# Altium project VHF_AMP.PrjPcb (part 5 of 5)

## Sheet VHFA_PWR_Supply.SchDoc: =MainTitle
size 420 x 297 mm; EDA_Number: ARTIQ; Projet: ARTIQ/SINARA; Author: G.Kasprowicz; CompanyName: WUT ISE; DrawnBy: G.Kasprowicz; Organization: WUT ISE; Address1: PW ISE; Address2: Nowowiejska 15/19 00-665 Warsaw; Address3: gkasprow@gmail.com; DocumentNumber: 5; Revision: 2; SheetNumber: 9; SheetTotal: 9; ModifiedBy: -; CheckedDate: -; Title2: Power supply & fan; DivGrp: WUT ISE; Designer: G.Kasprowicz; ModifiedDate: -; ProjectName: Sensor Box
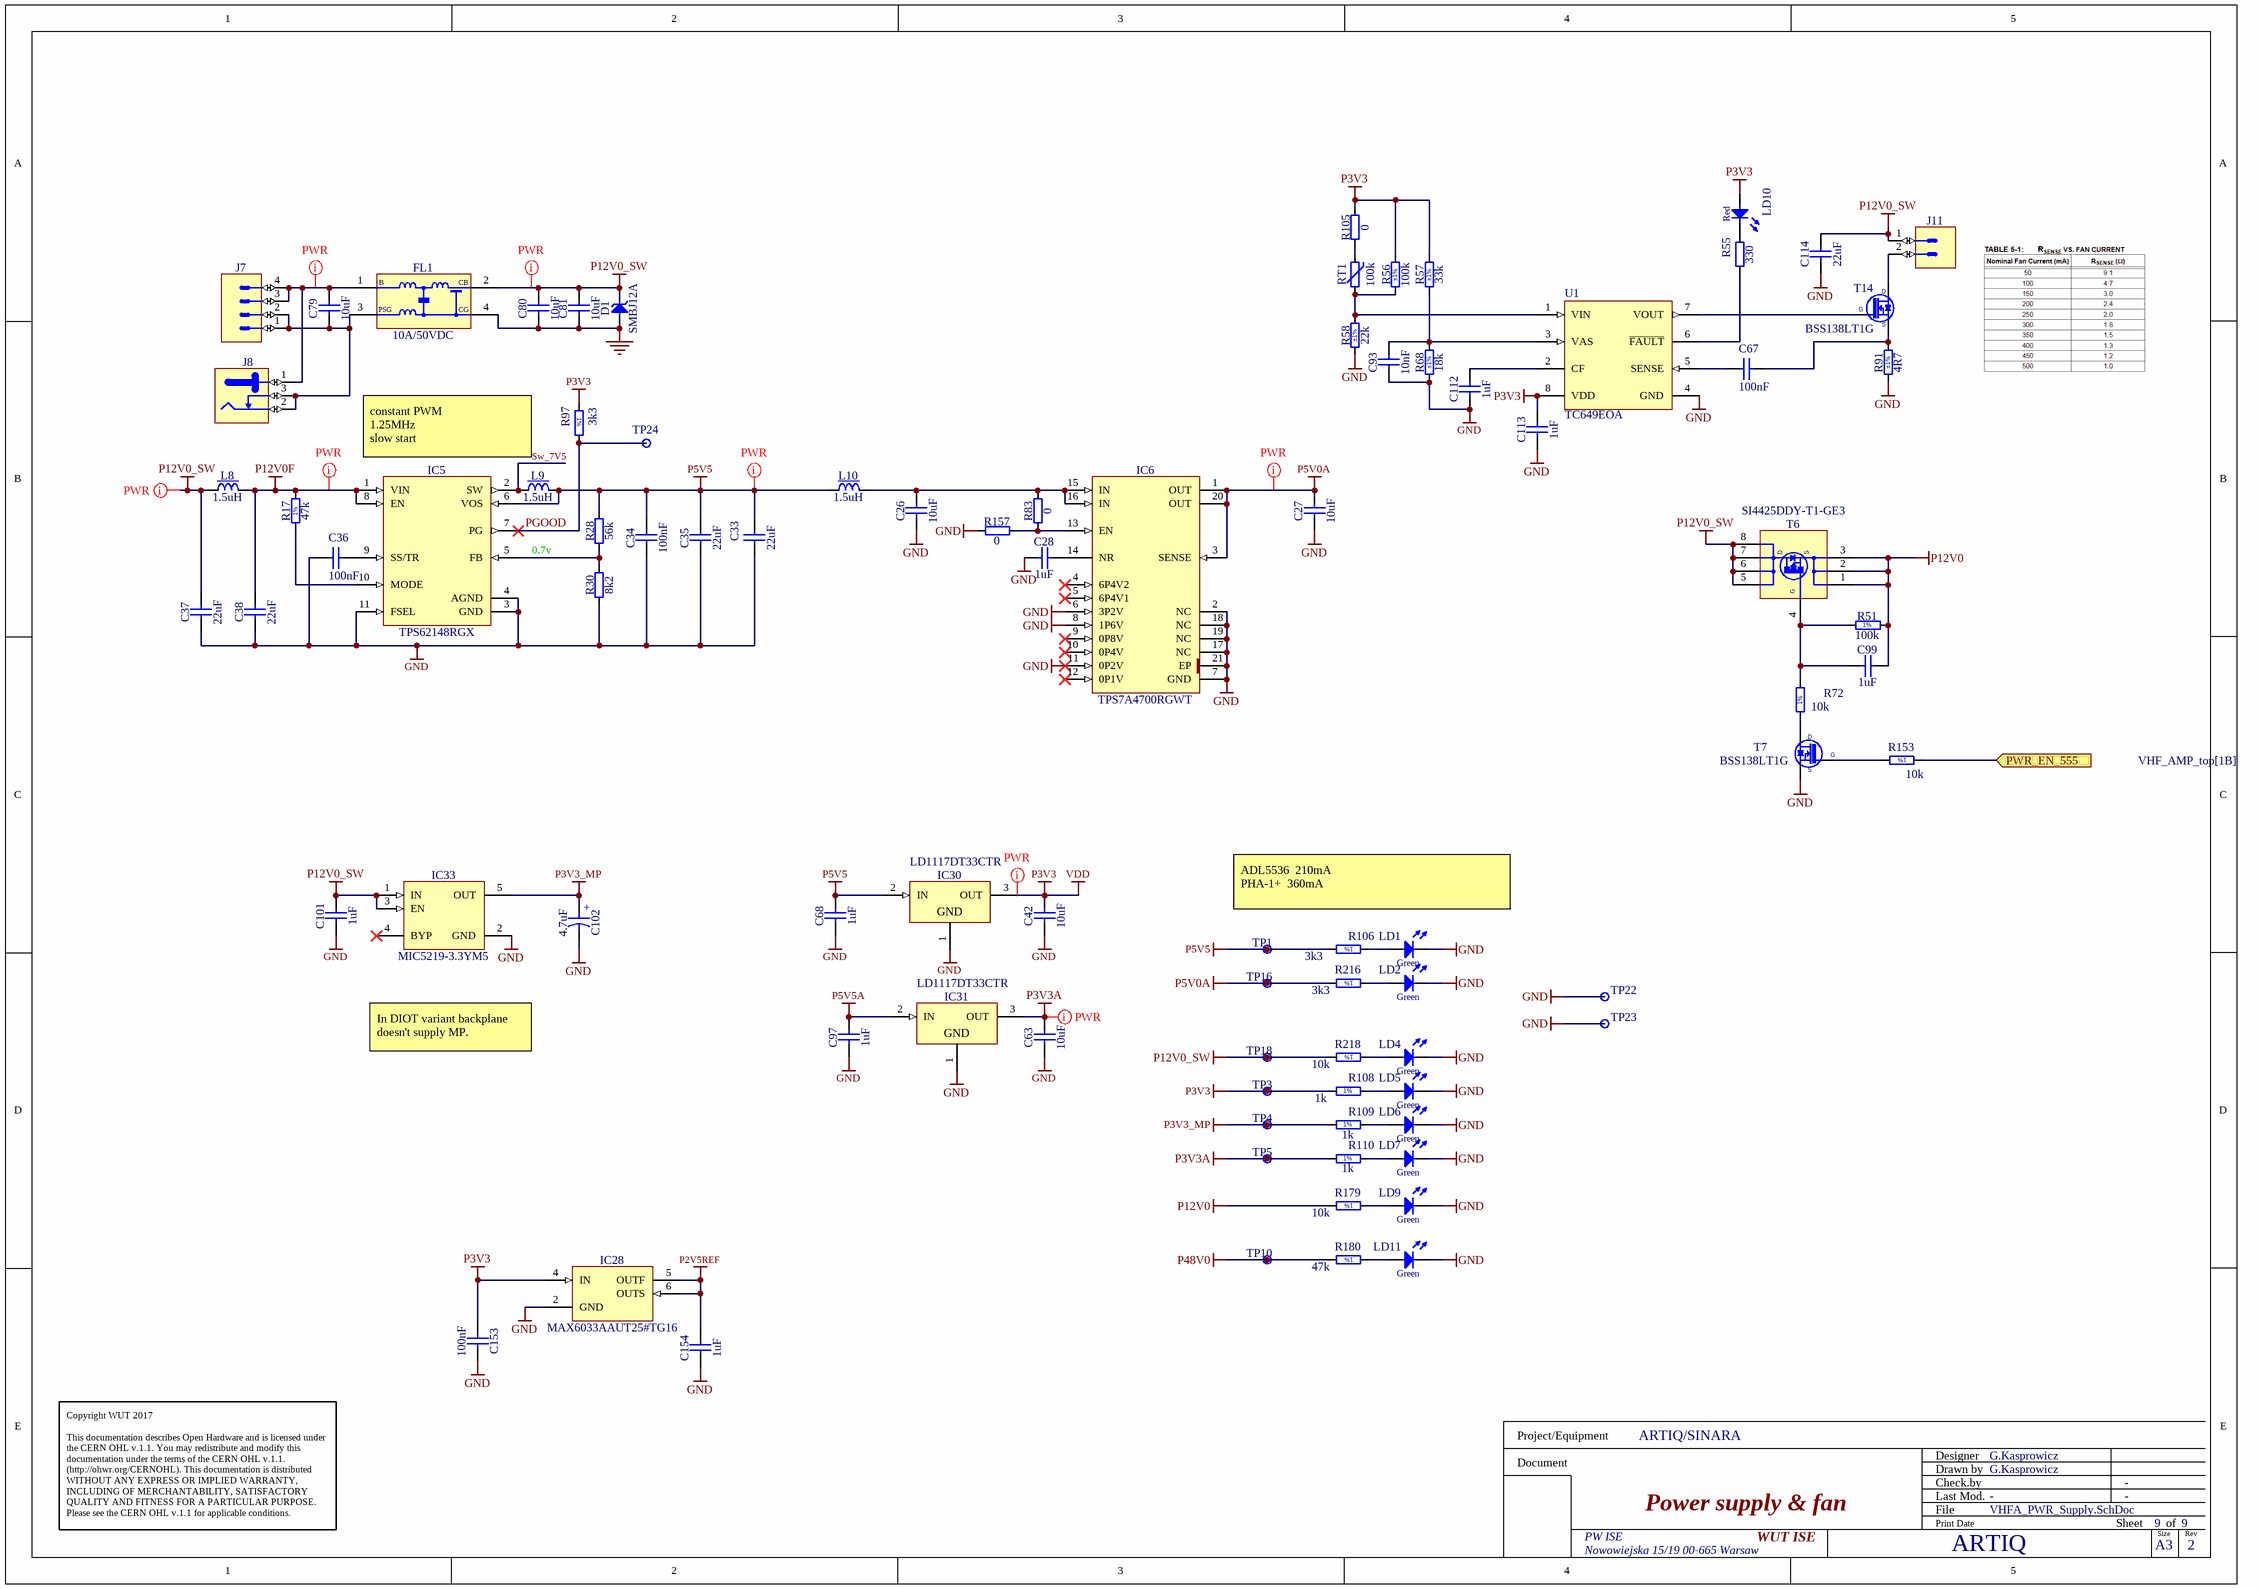
[diagram p8: VHFA_PWR_Supply.SchDoc]

### Parts
C26  10uF  [CAPC3216X140N]
C27  10uF  [CAPC3216X140N]
C28  1uF  [CAPC1608X87N]
C33  22uF  [CAPC3216X180N]
C34  100nF  [CAPC1005X55N]
C35  22uF  [CAPC3216X180N]
C36  100nF  [CAPC1005X55N]
C37  22uF  [CAPC3216X180N]
C38  22uF  [CAPC3216X180N]
C42  10uF  [CAPC3216X140N]
C63  10uF  [CAPC3216X140N]
C67  100nF  [CAPC1005X55N]
C68  1uF  [CAPC1608X87N]
C79  10uF  [CAPC2012X95N]
C80  10uF  [CAPC2012X95N]
C81  10uF  [CAPC2012X95N]
C93  10nF  [CAPC1608X87N]
C97  1uF  [CAPC1608X87N]
C99  1uF  [CAPC1005X55N]
C101  1uF  [CAPC1608X87N]
C102  4.7uF  [CAPMP3216X180N]
C112  1uF  [CAPC1608X87N]
C113  1uF  [CAPC1608X87N]
C114  22uF  [CAPC3216X180N]
C153  100nF  [CAPC1005X55N]
C154  1uF  [CAPC2012X110N]
D1  SMBJ12A  [DIOM5336X265N]
FL1  10A/50VDC  [FIL_MURATA_BNX02]
IC5  TPS62148RGX  [TEXAS_RGX0011A]
IC6  TPS7A4700RGWT  [QFN65P500X500X100-21N-S325]
IC28  MAX6033AAUT25#TG16  [SOT95P280X145-6N]
IC30  LD1117DT33CTR  [TO228P972X240-3N-R540X510]
IC31  LD1117DT33CTR  [TO228P972X240-3N-R540X510]
IC33  MIC5219-3.3YM5  [SOT95P280X145-5N]
J7  Mini-Fit Jr.™  [MOLEX_39-30-0040]  (value not drawn)
J8  Jack  [SWITCHCRAFT_712RA]  (value not drawn)
J11  KK®  [MOLEX_22-04-1021]  (value not drawn)
L8  1.5uH  [IND_TDK_SPM6530]
L9  1.5uH  [IND_TDK_SPM6530]
L10  1.5uH  [IND_TDK_SPM6530]
LD1  Green  [LED_KINGBRIGHT_KPH-1608CGCK]
LD2  Green  [LED_KINGBRIGHT_KPH-1608CGCK]
LD4  Green  [LED_KINGBRIGHT_KPH-1608CGCK]
LD5  Green  [LED_KINGBRIGHT_KPH-1608CGCK]
LD6  Green  [LED_KINGBRIGHT_KPH-1608CGCK]
LD7  Green  [LED_KINGBRIGHT_KPH-1608CGCK]
LD9  Green  [LED_KINGBRIGHT_KPH-1608CGCK]
LD10  Red  [LED_AVAGO_HSMC-C120]
LD11  Green  [LED_KINGBRIGHT_KPH-1608CGCK]
R17  47k  [RESC1608X55N]
R28  56k  [RESC1608X55N]
R30  8k2  [RESC1608X55N]
R51  100k  [RESC1608X55N]
R55  330  [RESC1005X40N]
R56  100k  Tolerance: ±1%  [RESC1005X40N]
R57  33k  Tolerance: ±1%  [RESC1005X40N]
R58  22k  Tolerance: ±1%  [RESC1005X40N]
R68  18k  Tolerance: ±1%  [RESC1005X40N]
R72  10k  [RESC1005X40N]
R83  0  [RESC1608X55N]
R91  4R7  Tolerance: ±1%  [RESC2012X60N]
R97  3k3  [RESC1608X55N]
R105  0  [RESC1005X40N]
R106  3k3  [RESC1608X55N]
R108  1k  [RESC1608X55N]
R109  1k  [RESC1608X55N]
R110  1k  [RESC1608X55N]
R153  10k  [RESC1005X40N]
R157  0  [RESC1608X55N]
R179  10k  [RESC1005X40N]
R180  47k  [RESC1005X40N]
R216  3k3  [RESC1608X55N]
R218  10k  [RESC1005X40N]
RT1  100k  [THERMC1608X95N]
T6  SI4425DDY-T1-GE3  [SOIC127P600X175-8N]
T7  BSS138LT1G  [SOT95P240X110-3N]
T14  BSS138LT1G  [SOT95P240X110-3N]
TP1  Test Point  [TPS127]  (value not drawn)
TP3  Test Point  [TPS127]  (value not drawn)
TP4  Test Point  [TPS127]  (value not drawn)
TP5  Test Point  [TPS127]  (value not drawn)
TP10  Test Point  [TPS127]  (value not drawn)
TP16  Test Point  [TPS127]  (value not drawn)
TP18  Test Point  [TPS127]  (value not drawn)
TP22  Test Point  [TPS127]  (value not drawn)
TP23  Test Point  [TPS127]  (value not drawn)
TP24  Test Point  [NICOMATIC_C12000B]  (value not drawn)
U1  TC649EOA  [SOIC127P600X175-8N]

### Ports
PWR_EN_555 (in, see VHF_AMP_top[1B])

### Nets
GND: C26.1 C27.1 C28.1 C33.1 C34.1 C35.1 C36.2 C37.1 C38.1 C42.1 C63.1 C68.1 C80.1 C81.1 C93.1 C97.1 C101.1 C102.2 C112.1 C113.1 C114.1 C153.2 C154.1 D1.2(A) FL1.4(CG) IC5.3(GND) IC5.4(AGND) IC5.11(FSEL) IC6.2(NC) IC6.6(3P2V) IC6.7(GND) IC6.8(1P6V) IC6.11(0P2V) IC6.17(NC) IC6.18(NC) IC6.19(NC) IC6.21(EP) IC28.2(GND) IC30.1(GND) IC31.1(GND) IC33.2(GND) LD1.1(C) LD2.1(C) LD4.1(C) LD5.1(C) LD6.1(C) LD7.1(C) LD9.1(C) LD11.1(C) R30.1 R58.1 R68.1 R91.1 R157.1 T7.2(S) TP22.1 TP23.1 U1.4(GND)
P2V5REF: C154.2 IC28.5(OUTF) IC28.6(OUTS)
P3V3: C42.2 C113.2 C153.1 IC28.4(IN) IC30.3(OUT) LD10.2(A) R56.2 R57.2 R97.1 R105.2 R108.1 TP3.1 U1.8(VDD)  [also labelled VDD]
P3V3_MP: C102.1 IC33.5(OUT) R109.1 TP4.1
P3V3A: C63.2 IC31.3(OUT) R110.1 TP5.1
P5V0A: C27.2 IC6.1(OUT) IC6.3(SENSE) IC6.20(OUT) R216.2 TP16.1
P5V5: C33.2 C34.2 C35.2 C68.2 IC5.6(VOS) IC30.2(IN) L9.2 L10.1 R28.2 R106.2 TP1.1
P5V5A: C97.2 IC31.2(IN)
P12V0: C99.2 R51.2 R179.2 T6.1(S) T6.2(S) T6.3(S)
P12V0_SW: C37.2 C80.2 C81.2 C101.2 C114.2 D1.1(C) FL1.2(CB) IC33.1(IN) IC33.3(EN) J11.1 L8.1 R218.2 T6.5(D) T6.6(D) T6.7(D) T6.8(D) TP18.1
P12V0F: C38.2 IC5.1(VIN) IC5.8(EN) L8.2 R17.2
P48V0: R180.2 TP10.1
PGOOD: IC5.7(PG) R97.2 TP24.1
PS_ON_BP: R153.1 ; port PWR_EN_555
Sw_7V5: IC5.2(SW) L9.1
NetC26_2: C26.2 IC6.15(IN) IC6.16(IN) L10.2 R83.2
NetC28_2: C28.2 IC6.14(NR)
NetC36_1: C36.1 IC5.9(SS/TR)
NetC67_1: C67.1 R91.2 T14.2(S)
NetC67_2: C67.2 U1.5(SENSE)
NetC79_1: C79.1 FL1.3(PSG) J7.1 J7.2 J8.2 J8.3
NetC79_2: C79.2 FL1.1(B) J7.3 J7.4 J8.1
NetC93_2: C93.2 R57.1 R68.2 U1.3(VAS)
NetC99_1: C99.1 R51.1 R72.2 T6.4(S)
NetC112_2: C112.2 U1.2(CF)
NetIC5_5: IC5.5(FB) R28.1 R30.2
NetIC5_10: IC5.10(MODE) R17.1
NetIC6_13: IC6.13(EN) R83.1 R157.2
NetJ11_2: J11.2 T14.3(D)
NetLD1_2: LD1.2(A) R106.1
NetLD2_2: LD2.2(A) R216.1
NetLD4_2: LD4.2(A) R218.1
NetLD5_2: LD5.2(A) R108.2
NetLD6_2: LD6.2(A) R109.2
NetLD7_2: LD7.2(A) R110.2
NetLD9_2: LD9.2(A) R179.1
NetLD10_1: LD10.1(C) R55.2
NetLD11_2: LD11.2(A) R180.1
NetR55_1: R55.1 U1.6(~{FAULT})
NetR56_1: R56.1 R58.2 RT1.1 U1.1(VIN)
NetR72_1: R72.1 T7.3(D)
NetR105_1: R105.1 RT1.2
NetR153_2: R153.2 T7.1(G)
NetT14_1: T14.1(G) U1.7(VOUT)

Not connected (* = marked no-connect by the designer): IC6 4(6P4V2)* 5(6P4V1)* 9(0P8V)* 10(0P4V)* 12(0P1V)*; IC33 4(BYP)*

### Layout directives
net class PWR: NetC79_2, P3V3, P3V3A, P5V0A, P5V5, P12V0_SW, P12V0F

### Notes on the sheet
- constant PWM
  1.25MHz
  slow start
- 0.7v
- ADL5536		210mA
  PHA-1+		360mA
- In DIOT variant backplane doesn't supply MP.
- Project/Equipment
- Document
- Designer
- Drawn by
- Check.by
- Copyright WUT 2017
  This documentation describes Open Hardware and is licensed under the CERN OHL v.1.1. You may redistribute and modify this documentation under the terms of the CERN OHL v.1.1. (http://ohwr.org/CERNOHL). This documentation is distributed WITHOUT ANY EXPRESS OR IMPLIED WARRANTY, INCLUDING OF MERCHANTABILITY, SATISFACTORY QUALITY AND FITNESS FOR A PARTICULAR PURPOSE. Please see the CERN OHL v.1.1 for applicable conditions.
- File
- Last Mod.
- Print Date
- Sheet
- Size
- A3
- of
- Rev
- (in symbol CTE3216-18_4.7UF_10V_10%_AVX_TPSA475K010T1400) +
- (in symbol R0402_10K_1%_0.0625W_100PPM) 1%
- (in symbol R0402_47K_1%_0.0625W_100PPM) 1%
- (in symbol R0603_1K_1%_0.1W_100PPM) 1%
- (in symbol R0603_3k3_1%_0.1W_100PPM) 1%
- (in symbol R0603_47K_1%_0.1W_100PPM) 1%
- (in symbol R0603_100K_1%_0.1W_100PPM) 1%
- (in symbol SI4425DDY-T1-GE3) G

### Library data of the parts
C26 C27 C42 C63 = CC1206_10UF_10V_10%_X7R: Non-polarised capacitor; Part Description: SMD Multilayer Chip Ceramic Capacitor; Manufacturer: GENERIC; Manufacturer1 Part Number: C1206C106K8RAC; Voltage: 10V; TC: X7R; Tolerance: ±10%; Part Number: CC1206_10UF_10V_10%_X7R; Component Kind: Standard; Component Type: Standard; Pin Count: 2; Value: 10uF; Status: Preferred; Manufacturer Part Number: CC1206_10UF_10V_10%_X7R; Case: 1206; Mounted: Yes; Socket: No; SMD: Yes; Sense: No; Manufacturer1 Example: KEMET; Manufacturer1 ComponentHeight: 1.8mm; HelpURL: \\cern.ch\dfs\Applications\Altium\Datasheets\CC1206_X7R_KEMET.pdf; Author: CERN DEM JLC; CreateDate: 03.12.2007; LatestRevisionDate: 03.12.2007
C28 C68 C97 C112 C113 = CC0603_1UF_16V_10%_X7R: Non-polarised capacitor; Part Description: SMD Multilayer Chip Ceramic Capacitor; Manufacturer: GENERIC; Manufacturer1 Part Number: 223878615663; Voltage: 16V; TC: X7R; Tolerance: ±10%; Part Number: CC0603_1UF_16V_10%_X7R; Component Kind: Standard; Component Type: Standard; Pin Count: 2; Value: 1uF; Status: None; Case: 0603; Mounted: Yes; Socket: No; SMD: Yes; Sense: No; Manufacturer1 Example: YAGEO PHYCOMP; Manufacturer1 ComponentHeight: 0.9mm; HelpURL: \\cern.ch\dfs\Applications\Altium\Datasheets\CC0603_X7R_PHYCOMP.pdf; Author: CERN DEM JLC; CreateDate: 03.12.2007; LatestRevisionDate: 17.04.2015
  C28: Manufacturer Part Number: CC0603_1UF_16V_10%_X7R
  C68 C97 C112 C113: Manufacturer Part Number: CC0603_1uF_16V_10%_X7R
C33 C35 C37 C38 C114 = CC1206_22UF_35V_20%_JB_TDK_C3216JB1V226M160AC: Non-polarised capacitor; Part Description: SMD Multilayer Chip Ceramic Capacitor; Manufacturer: TDK; Voltage: 35V; TC: JB(±10%); Tolerance: ±20%; Part Number: CC1206_22UF_35V_20%_JB_TDK_C3216JB1V226M160AC; Component Kind: Standard; Component Type: Standard; Pin Count: 2; Value: 22uF; Status: None; Manufacturer Part Number: C3216JB1V226M160AC; Case: 1206; Mounted: Yes; Socket: No; SMD: Yes; Sense: No; HelpURL: \\cern.ch\dfs\Applications\Altium\Datasheets\CC1206_TDK_C3216JB1V226M160AC.pdf; Author: CERN DEM JLC; CreateDate: 13.07.2017; LatestRevisionDate: 13.07.2017; ComponentHeight: 1.8mm
C34 C36 C67 = CC0402_100NF_16V_10%_X5R: as C10 on sheet VHFA_EEM; Part Number: CC0402_100NF_16V_10%_X5R; Component Kind: Standard; Component Type: Standard; Pin Count: 2; Value: 100nF; Status: None; Manufacturer Part Number: CC0402_100NF_16V_10%_X5R; Case: 0402; Mounted: Yes; Socket: No; SMD: Yes; Sense: No; Manufacturer1 Example: MURATA; Manufacturer1 ComponentHeight: 0.55mm; HelpURL: \\cern.ch\dfs\Applications\Altium\Datasheets\CC0402_X5R_MURATA_GRM.pdf; Author: CERN DEM JLC; CreateDate: 10.12.2013; LatestRevisionDate: 10.12.2013
C79-C81 = CC0805_10UF_25V_10%_X5R: Non-polarised capacitor; Part Description: SMD Multilayer Chip Ceramic Capacitor; Manufacturer: GENERIC; Manufacturer1 Part Number: GRM219R61E106KA12D; Voltage: 25V; TC: X5R; Tolerance: ±10%; Part Number: CC0805_10UF_25V_10%_X5R; Component Kind: Standard; Component Type: Standard; Pin Count: 2; Value: 10uF; Status: Preferred; Manufacturer Part Number: CC0805_10UF_25V_10%_X5R; Case: 0805; Mounted: Yes; Socket: No; SMD: Yes; Sense: No; Manufacturer1 Example: MURATA; Manufacturer1 ComponentHeight: 0.95mm; HelpURL: \\cern.ch\dfs\Applications\Altium\Datasheets\CC0805_X5R_MURATA_GRM.pdf; Author: CERN DEM JLC; CreateDate: 25.10.2012; LatestRevisionDate: 06.09.2016
C93 = CC0603_10NF_50V_10%_X7R: Non-polarised capacitor; Part Description: SMD Multilayer Chip Ceramic Capacitor; Manufacturer: GENERIC; Manufacturer1 Part Number: 223858615636; Voltage: 50V; TC: X7R; Tolerance: ±10%; Part Number: CC0603_10NF_50V_10%_X7R; Component Kind: Standard; Component Type: Standard; Pin Count: 2; Value: 10nF; Status: Preferred; Manufacturer Part Number: CC0603_10NF_50V_10%_X7R; Case: 0603; Mounted: Yes; Socket: No; SMD: Yes; Sense: No; Manufacturer1 Example: PHYCOMP; Manufacturer1 ComponentHeight: 0.87mm; HelpURL: \\cern.ch\dfs\Applications\Altium\Datasheets\CC0603_X7R_PHYCOMP.pdf; Author: CERN DEM JLC; CreateDate: 03.12.2007; LatestRevisionDate: 03.12.2007
C99 = CC0402_1UF_16V_10%_X5R: Non-polarised capacitor; Part Description: SMD Multilayer Chip Ceramic Capacitor; Manufacturer: GENERIC; Manufacturer1 Part Number: C1005X5R1C105KT; Voltage: 16V; TC: X5R; Tolerance: ±10%; Part Number: CC0402_1UF_16V_10%_X5R; Component Kind: Standard; Component Type: Standard; Pin Count: 2; Value: 1uF; Status: Preferred; Manufacturer Part Number: CC0402_1UF_16V_10%_X5R; Case: 0402; Mounted: Yes; Socket: No; SMD: Yes; Sense: No; Manufacturer1 Example: TDK; Manufacturer1 ComponentHeight: 0.55mm; HelpURL: \\cern.ch\dfs\Applications\Altium\Datasheets\CC0402_X5R_TDK_C.pdf; Author: CERN DEM JLC; CreateDate: 2012-10-25; LatestRevisionDate: 2012-10-25
C101 = CC0603_1UF_25V_10%_X7R: Non-polarised capacitor; Part Description: SMD Multilayer Chip Ceramic Capacitor; Manufacturer: GENERIC; Manufacturer1 Part Number: GRM188R71E105KA12D; Voltage: 25V; TC: X7R; Tolerance: ±10%; Part Number: CC0603_1UF_25V_10%_X7R; Component Kind: Standard; Component Type: Standard; Pin Count: 2; Value: 1uF; Status: None; Manufacturer Part Number: CC0603_1UF_25V_10%_X7R; Case: 0603; Mounted: Yes; Socket: No; SMD: Yes; Sense: No; Manufacturer1 Example: MURATA; Manufacturer1 ComponentHeight: 0.9mm; HelpURL: \\cern.ch\dfs\Applications\Altium\Datasheets\CC0603_X7R_MURATA.pdf; Author: CERN DEM JLC; CreateDate: 18.01.2011; LatestRevisionDate: 18.01.2011
C102 = CTE3216-18_4.7UF_10V_10%_AVX_TPSA475K010T1400: Polarised capacitor; Part Description: Low ESR 1R4 Automotive Solid Tantalum Chip Capacitor; Manufacturer: AVX; Voltage: 10V; Tolerance: ±10%; Part Number: CTE3216-18_4.7UF_10V_10%_AVX_TPSA475K010T1400; Component Kind: Standard; Component Type: Standard; Pin Count: 2; Value: 4.7uF; Status: Preferred; Manufacturer Part Number: TPSA475K010T1400; Case: A; Mounted: Yes; Socket: No; SMD: Yes; Sense: No; ComponentHeight: 1.8mm; HelpURL: \\cern.ch\dfs\Applications\Altium\Datasheets\CTE-LESR_AVX_TPS-AUTO.pdf; Author: CERN DEM JLC; CreateDate: 23.01.2018; LatestRevisionDate: 23.01.2018
C153 = CC0402_100NF_16V_10%_X5R: Non-polarised capacitor; Part Description: SMD Multilayer Chip Ceramic Capacitor; Manufacturer: GENERIC; Manufacturer1 Part Number: GRM155R61C104KA88D; Voltage: 16V; TC: X5R; Tolerance: ±10%; Table: Capacitors SMD; Part Number: CC0402_100NF_16V_10%_X5R; Component Kind: Standard; Component Type: Standard; Pin Count: 2; Value: 100nF; Status: None; Manufacturer Part Number: CC0402_100NF_16V_10%_X5R; Case: 0402; Mounted: Yes; Socket: No; SMD: Yes; Manufacturer1 Example: MURATA; Manufacturer1 ComponentHeight: 0.55mm; HelpURL: \\cern.ch\dfs\Applications\Altium\Datasheets\CC0402_X5R_MURATA_GRM.pdf; Author: CERN DEM JLC; CreateDate: 2013-12-10; LatestRevisionDate: 2013-12-10
C154 = CC0805_1UF_50V_10%_X7R: Non-polarised capacitor; Part Description: SMD Multilayer Chip Ceramic Capacitor; Manufacturer: GENERIC; Manufacturer1 Part Number: C0805C105K5RACTU; Voltage: 50V; TC: X7R; Tolerance: ±10%; Part Number: CC0805_1UF_50V_10%_X7R; Component Kind: Standard; Component Type: Standard; Pin Count: 2; Value: 1uF; Status: Preferred; Manufacturer Part Number: CC0805_1UF_50V_10%_X7R; Case: 0805; Mounted: Yes; Socket: No; SMD: Yes; Sense: No; Manufacturer1 Example: KEMET; Manufacturer1 ComponentHeight: 1.1mm; HelpURL: \\cern.ch\dfs\Applications\Altium\Datasheets\CC0805_X7R_KEMET.pdf; Author: CERN DEM JLC; CreateDate: 04.12.2013; LatestRevisionDate: 04.12.2013
D1 = SMBJ12A: Zener Diode; Part Description: Uni-Directional Transient Voltage Suppressor Diode; Manufacturer: FAIRCHILD SEMICONDUCTOR; Voltage: 12V; Power: 600W; PressFit: No; Bonding: No; Part Number: SMBJ12A; Component Kind: Standard; Component Type: Standard; Device: SMBJ12A; PackageDescription: DO-214-AA/SMB Diode, Molded Body; 5.34mm L X 3.625mm W X 2.65mm H, IPC Medium Density; Manufacturer Part Number: SMBJ12A; Pin Count: 2; Case: DO-214AA; Mounted: Yes; Socket: No; SMD: Yes; Sense: No; ComponentHeight: 2.65mm; HelpURL: \\cern.ch\dfs\Applications\Altium\Datasheets\SMBJ.pdf; Author: CERN DEM JLC; CreateDate: 10.04.2013; LatestRevisionDate: 10.04.2013
FL1 = FIL_MURATA_BNX022-01L: Block Type EMIFIL (LC Combined); Part Description: Block Type EMIFIL (LC Combined) SMD Type, BNX02* Series; Manufacturer: MURATA; Resistance: 0.5R; Part Number: FIL_MURATA_BNX022-01L; Component Kind: Standard; Component Type: Standard; Pin Count: 2; Value: 10A/50VDC; Status: None; Manufacturer Part Number: BNX022-01L; Mounted: Yes; Socket: No; SMD: Yes; Sense: No; ComponentHeight: 3.3mm; HelpURL: \\cern.ch\dfs\Applications\Altium\Datasheets\FIL_MURATA_BNX022-01L.pdf; Author: CERN DEM JLC; CreateDate: 10.10.2012; LatestRevisionDate: 10.10.2012
IC5 = TPS62148RGX: 3V-17V 2A Step-Down Converter, High Accuracy, With DCS-Control; Manufacturer: TEXAS INSTRUMENTS; PressFit: No; Bonding: No; Part Number: TPS62148RGX; Component Kind: Standard; Component Type: Standard; Device: TPS62148RGX; PackageDescription: TEXAS Case Style (R-VQFN-HR-N11), 0.50mm Pitch, 11-pin, 2.00mm W X 3.00mm L X 1.00mm H Body; Part Description: 3V-17V 2A Step-Down Converter, High Accuracy, With DCS-Control; Manufacturer Part Number: TPS62148RGX; Pin Count: 11; Case: QFN14; Mounted: Yes; Socket: No; SMD: Yes; Sense: No; ComponentHeight: 1mm; HelpURL: \\cern.ch\dfs\Applications\Altium\Datasheets\TPS62148RGX.pdf; Author: CERN DEM MR; CreateDate: 08.02.2019; LatestRevisionDate: 08.02.2019
IC6 = TPS7A4700RGWT: Low Noise (3uVrms), 1A, High Voltage Low-Dropout Linear Regulator; Part Description: 1.4V to 19.1V, 1A, Low Noise (3.5uVrms), Low-Dropout Linear Regulator; Manufacturer: TEXAS INSTRUMENTS; PressFit: No; Bonding: No; Part Number: TPS7A4700RGWT; Component Kind: Standard; Component Type: Standard; Device: TPS7A4700RGWT; PackageDescription: QFN, 0.65mm Pitch, Square; 20 Pin, 5.00mm L X 5.00mm W X 1.00mm H body (w/Thermal Tab 3.25 X 3.25mm), IPC Medium Density; Manufacturer Part Number: TPS7A4700RGW; Pin Count: 21; Case: QFN20; Mounted: Yes; Socket: No; SMD: Yes; Sense: No; ComponentHeight: 1mm; HelpURL: \\cern.ch\dfs\Applications\Altium\Datasheets\TPS7A4700RGWT.pdf; Author: CERN DEM JLC; CreateDate: 03.07.2012; LatestRevisionDate: 13.06.2022
IC28 = MAX6033AAUT25#TG16: Ultra-High-Precision Voltage References; Part Description: 2.5V, 15mA, Ultra-High-Precision Voltage References; Manufacturer: MAXIM; PressFit: No; Bonding: No; Part Number: MAX6033AAUT25#TG16; Component Kind: Standard; Component Type: Standard; Device: MAX6033AAUT25#TG16; PackageDescription: SOT23, 0.95mm pitch; 6 pin, 1.6mm W X 2.9mm L X 1.45mm H body, IPC Medium Density; Manufacturer Part Number: MAX6033AAUT25#TG16; Pin Count: 4; Case: SOT23-6; Mounted: Yes; Socket: No; SMD: Yes; Sense: No; ComponentHeight: 1.45mm; HelpURL: \\cern.ch\dfs\Applications\Altium\Datasheets\MAX6033AAUT25#TG16.pdf; Author: CERN DEM JLC; CreateDate: 02.05.2012; LatestRevisionDate: 02.05.2012
IC30 IC31 = LD1117DT33CTR: 3-Terminal Regulator 1=GND 2=IN 3=OUT; Part Description: 3.3V 800mA Low drop fixed and adjustable positive voltage regulators; Manufacturer: ST MICROELECTRONICS; PressFit: No; Bonding: No; Part Number: LD1117DT33CTR; Component Kind: Standard; Component Type: Standard; Device: LD1117DT33CTR; PackageDescription: TO-252 DPAK TO, 2.28mm Pitch; 2 Pin, 9.725mm L X 6.10mm W X 2.40mm H body, IPC Medium Density; Manufacturer Part Number: LD1117DT33CTR; Pin Count: 3; Case: DPAK; Mounted: Yes; Socket: No; SMD: Yes; Sense: No; ComponentHeight: 2.4mm; HelpURL: \\cern.ch\dfs\Applications\Altium\Datasheets\LD1117DT33CTR.pdf; Author: CERN DEM JLC; CreateDate: 08.06.2011; LatestRevisionDate: 08.06.2011
IC33 = MIC5219-3.3YM5: 500mA Peak Output LDO Regulator; Part Description: 3.3V 500mA Peak Output Low Drop-Out  (LDO) Regulator; Manufacturer: MICROCHIP TECHNOLOGY; PressFit: No; Bonding: No; Part Number: MIC5219-3.3YM5; Component Kind: Standard; Component Type: Standard; Device: MIC5219-3.3YM5; PackageDescription: SOT, 0.95mm pitch; 5 pin, 1.60mm W X 2.90mm L X 1.45mm H body, IPC Medium Density; Manufacturer Part Number: MIC5219-3.3YM5; Pin Count: 5; Case: SOT23-5; Mounted: Yes; Socket: No; SMD: Yes; Sense: No; ComponentHeight: 1.45mm; HelpURL: \\cern.ch\dfs\Applications\Altium\Datasheets\MIC5219-3.3YM5.pdf; Author: CERN DEM WB; CreateDate: 2019-04-16; LatestRevisionDate: 2019-04-16
J7 = MOLEX_39-30-0040: Connector 4 Male; Part Description: 4.20mm (.165") Pitch Mini-Fit Jr. Header, Dual Row, Right Angle with Snap-in Plastic Peg PCB Lock, 4 Circuits; Manufacturer: MOLEX; PressFit: No; Part Number: MOLEX_39-30-0040; Component Kind: Standard; Component Type: Standard; Pin Count: 4; Family: Mini-Fit Jr.™; Mounted: Yes; Socket: No; SMD: No; Sense: No; Status: None; Manufacturer Part Number: 39-30-0040; ComponentHeight: 11.4mm; HelpURL: \\cern.ch\dfs\Applications\Altium\Datasheets\MOLEX_39-30-0040.pdf; Author: CERN DEM JLC; CreateDate: 2018-10-02; LatestRevisionDate: 2018-10-02
J8 = SWITCHCRAFT_712RA: 2.5 mm Center Pin, 5A, 48V, Right Angle, Through Hole, , DC Power Jack Connector; Part Description: 2.5 mm Center Pin, 5A, 48VDC, Right Angle, Through Hole, Locking Power Jack Connector (Threaded Bushings); Manufacturer Part Number: 712RA; PressFit: No; Part Number: SWITCHCRAFT_712RA; Component Kind: Standard; Component Type: Standard; Pin Count: 3; Family: Jack; Mounted: Yes; Socket: No; SMD: No; Sense: No; Status: None; Manufacturer: SWITCHCRAFT; ComponentHeight: 13.8mm; HelpURL: \\cern.ch\dfs\Applications\Altium\Datasheets\SWITCHCRAFT_712RA.pdf; Author: CERN DEM JLC; CreateDate: 2017-12-19; LatestRevisionDate: 2017-12-19
J11 = MOLEX_22-04-1021: Connector 2 Male; Part Description: 2.5mm (.100") Pitch KK® Wire-to-Board Header, Vertical, with Friction Lock, 2 Circuits, Tin (Sn) Plating; Manufacturer: MOLEX; PressFit: No; Part Number: MOLEX_22-04-1021; Component Kind: Standard; Component Type: Standard; Pin Count: 2; Family: KK®; Mounted: Yes; Socket: No; SMD: No; Sense: No; Status: None; Manufacturer Part Number: 22-04-1021; ComponentHeight: 11.7mm; HelpURL: \\cern.ch\dfs\Applications\Altium\Datasheets\MOLEX_22-04-1021.pdf; Author: CERN DEM JLC; CreateDate: 09.02.2012; LatestRevisionDate: 09.02.2012
L8-L10 = IND_1.5UH_20%_TDK_SPM6530: Inductor With Core; Part Description: SMD Inductor for Power Circuits (Wound Metal), SPM Series; Manufacturer: TDK; Manufacturer Part Number: SPM6530T-1R5M100; Power: 11A; Resistance: 0.0097R; Tolerance: ±20%; Part Number: IND_1.5UH_20%_TDK_SPM6530; Component Kind: Standard; Component Type: Standard; Pin Count: 2; Value: 1.5uH; Status: None; Mounted: Yes; Socket: No; SMD: Yes; Sense: No; ComponentHeight: 3mm; HelpURL: \\cern.ch\dfs\Applications\Altium\Datasheets\IND_TDK_SPM6530.pdf; Author: CERN DEM MR; CreateDate: 08.11.2016; LatestRevisionDate: 08.11.2016
LD1 LD2 LD4-LD7 LD9 LD11 = LED_KINGBRIGHT_KPH-1608CGCK: LED Green 1C 2A; Part Description: SMD Green LED, Case 1.6mmX0.8mm(0603), 0.65mm Thickness; PressFit: No; Bonding: No; Part Number: LED_KINGBRIGHT_KPH-1608CGCK; Component Kind: Standard; Component Type: Standard; Color: Green; PackageDescription: SMT Green LED, Case 0603, Body L 1.6 x W 0.8mm H 0.65mm; Manufacturer: KINGBRIGHT; Manufacturer Part Number: KPH-1608CGCK; Pin Count: 2; Mounted: Yes; Socket: No; SMD: Yes; Sense: No; ComponentHeight: 0.65mm; HelpURL: \\cern.ch\dfs\Applications\Altium\Datasheets\LED_KINGBRIGHT_KPH-1608CGCK.pdf; Author: CERN DEM JLC; CreateDate: 03.07.2017; LatestRevisionDate: 03.07.2017
LD10 = LED_AVAGO_HSMC-C120: LED Red 1C 2A; Part Description: High Performance Right Angle Chip Red LED; Manufacturer: AVAGO TECHNOLOGIES; PressFit: No; Bonding: No; Part Number: LED_AVAGO_HSMC-C120; Component Kind: Standard; Component Type: Standard; Color: Red; PackageDescription: Red Chip LED, 2-Leads, Body 1.7x1.1mm, Side Emitting Package; Manufacturer Part Number: HSMC-C120; Pin Count: 2; Mounted: Yes; Socket: No; SMD: Yes; Sense: No; ComponentHeight: 0.7mm; HelpURL: \\cern.ch\dfs\Applications\Altium\Datasheets\LED_AVAGO_HSMC-C120.pdf; ComponentLink1URL: \\cern.ch\dfs\Applications\Altium\Datasheets\LED_AVAGO_HSMC-C120_DESIGN-GUIDE.pdf; ComponentLink1Description: Design Guide; Author: CERN DEM JMW; CreateDate: 22.07.2009; LatestRevisionDate: 20.06.2012
R17 = R0603_47K_1%_0.1W_100PPM: Resistor - 1%; Part Description: General Purpose Thick Film Chip Resistor; Manufacturer: GENERIC; Manufacturer1 Part Number: NRC06F4702TRF; Power: 0.1W; TC: ±100ppm/°C; Part Number: R0603_47K_1%_0.1W_100PPM; Component Kind: Standard; Component Type: Standard; Pin Count: 2; Value: 47k; Status: Preferred; Tolerance: ±1%; Manufacturer Part Number: R0603_47K_1%_0.1W_100PPM; Case: 0603; Mounted: Yes; Sense: No; Socket: No; SMD: Yes; Manufacturer1 Example: NIC COMPONENT; Manufacturer1 ComponentHeight: 0.55mm; HelpURL: \\cern.ch\dfs\Applications\Altium\Datasheets\R0603_NIC_NRC.pdf; Author: CERN DEM JLC; CreateDate: 03.12.2007; LatestRevisionDate: 13.03.2008
R28 = R0603_56K_1%_0.1W_100PPM: Resistor - 1%; Part Description: General Purpose Thick Film Chip Resistor; Manufacturer: GENERIC; Manufacturer1 Part Number: NRC06F5602TRF; Power: 0.1W; TC: ±100ppm/°C; PressFit: No; Part Number: R0603_56K_1%_0.1W_100PPM; Component Kind: Standard; Component Type: Standard; Pin Count: 2; Value: 56k; Status: Preferred; Tolerance: ±1%; Manufacturer Part Number: R0603_56K_1%_0.1W_100PPM; Case: 0603; Mounted: Yes; Sense: No; Socket: No; SMD: Yes; Manufacturer1 Example: NIC COMPONENT; Manufacturer1 ComponentHeight: 0.55mm; HelpURL: \\cern.ch\dfs\Applications\Altium\Datasheets\R0603_NIC_NRC.pdf; Author: CERN DEM JLC; CreateDate: 03.12.2007; LatestRevisionDate: 13.03.2008
R30 = R0603_8k2_1%_0.1W_100PPM: Resistor - 1%; Part Description: General Purpose Thick Film Chip Resistor; Manufacturer: GENERIC; Manufacturer1 Part Number: NRC06F8201TRF; Power: 0.1W; TC: ±100ppm/°C; PressFit: No; Part Number: R0603_8K2_1%_0.1W_100PPM; Component Kind: Standard; Component Type: Standard; Pin Count: 2; Value: 8k2; Status: Preferred; Tolerance: ±1%; Manufacturer Part Number: R0603_8K2_1%_0.1W_100PPM; Case: 0603; Mounted: Yes; Sense: No; Socket: No; SMD: Yes; Manufacturer1 Example: NIC COMPONENT; Manufacturer1 ComponentHeight: 0.55mm; HelpURL: \\cern.ch\dfs\Applications\Altium\Datasheets\R0603_NIC_NRC.pdf; Author: CERN DEM JLC; CreateDate: 03.12.2007; LatestRevisionDate: 13.03.2008
R51 = R0603_100K_1%_0.1W_100PPM: Resistor - 1%; Part Description: General Purpose Thick Film Chip Resistor; Manufacturer: GENERIC; Manufacturer1 Part Number: NRC06F1003TRF; Power: 0.1W; TC: ±100ppm/°C; Part Number: R0603_100K_1%_0.1W_100PPM; Component Kind: Standard; Component Type: Standard; Pin Count: 2; Value: 100k; Status: Preferred; Tolerance: ±1%; Manufacturer Part Number: R0603_100K_1%_0.1W_100PPM; Case: 0603; Mounted: Yes; Sense: No; Socket: No; SMD: Yes; Manufacturer1 Example: NIC COMPONENT; Manufacturer1 ComponentHeight: 0.55mm; HelpURL: \\cern.ch\dfs\Applications\Altium\Datasheets\R0603_NIC_NRC.pdf; Author: CERN DEM JLC; CreateDate: 2007-12-03; LatestRevisionDate: 2008-03-13
R55 = R0402_330R_1%_0.0625W_100PPM: Resistor - 1%; Part Description: General Purpose Thick Film Chip Resistor; Manufacturer: GENERIC; Manufacturer1 Part Number: 232270673301L; TC: ±100ppm/°C; PressFit: No; Part Number: R0402_330R_1%_0.0625W_100PPM; Component Kind: Standard; Component Type: Standard; Pin Count: 2; Value: 330; Status: Not Recommended; Power: 0.0625W; Tolerance: ±1%; Manufacturer Part Number: R0402_330R_1%_0.0625W_100PPM; Case: 0402; Mounted: Yes; Sense: No; Socket: No; SMD: Yes; Manufacturer1 Example: YAGEO PHYCOMP; Manufacturer1 ComponentHeight: 0.4mm; HelpURL: \\cern.ch\dfs\Applications\Altium\Datasheets\R0402_Phycomp_RC0402.pdf; Author: CERN DEM JLC; CreateDate: 03.12.2007; LatestRevisionDate: 17.10.2012
R56 = R0402_100K_1%_0.0625W_100PPM: Resistor - 1%; Part Description: General Purpose Thick Film Chip Resistor; Manufacturer: GENERIC; Manufacturer1 Part Number: 232270671004L; TC: ±100ppm/°C; PressFit: No; Part Number: R0402_100K_1%_0.0625W_100PPM; Component Kind: Standard; Component Type: Standard; Pin Count: 2; Value: 100k; Status: Not Recommended; Power: 0.0625W; Manufacturer Part Number: R0402_100K_1%_0.0625W_100PPM; Case: 0402; Mounted: Yes; Sense: No; Socket: No; SMD: Yes; Manufacturer1 Example: YAGEO PHYCOMP; Manufacturer1 ComponentHeight: 0.4mm; HelpURL: \\cern.ch\dfs\Applications\Altium\Datasheets\R0402_Phycomp_RC0402.pdf; Author: CERN DEM JLC; CreateDate: 03.12.2007; LatestRevisionDate: 17.10.2012
R57 = R0402_33K_1%_0.0625W_100PPM: Resistor - 1%; Part Description: General Purpose Thick Film Chip Resistor; Manufacturer: GENERIC; Manufacturer1 Part Number: 232270673303L; TC: ±100ppm/°C; PressFit: No; Part Number: R0402_33K_1%_0.0625W_100PPM; Component Kind: Standard; Component Type: Standard; Pin Count: 2; Value: 33k; Status: Not Recommended; Power: 0.0625W; Manufacturer Part Number: R0402_33K_1%_0.0625W_100PPM; Case: 0402; Mounted: Yes; Sense: No; Socket: No; SMD: Yes; Manufacturer1 Example: YAGEO PHYCOMP; Manufacturer1 ComponentHeight: 0.4mm; HelpURL: \\cern.ch\dfs\Applications\Altium\Datasheets\R0402_Phycomp_RC0402.pdf; Author: CERN DEM JLC; CreateDate: 03.12.2007; LatestRevisionDate: 17.10.2012
R58 = R0402_22K_1%_0.0625W_100PPM: Resistor - 1%; Part Description: General Purpose Thick Film Chip Resistor; Manufacturer: GENERIC; Manufacturer1 Part Number: 232270672203L; TC: ±100ppm/°C; PressFit: No; Part Number: R0402_22K_1%_0.0625W_100PPM; Component Kind: Standard; Component Type: Standard; Pin Count: 2; Value: 22k; Status: Not Recommended; Power: 0.0625W; Manufacturer Part Number: R0402_22K_1%_0.0625W_100PPM; Case: 0402; Mounted: Yes; Sense: No; Socket: No; SMD: Yes; Manufacturer1 Example: YAGEO PHYCOMP; Manufacturer1 ComponentHeight: 0.4mm; HelpURL: \\cern.ch\dfs\Applications\Altium\Datasheets\R0402_Phycomp_RC0402.pdf; Author: CERN DEM JLC; CreateDate: 03.12.2007; LatestRevisionDate: 17.10.2012
R68 = R0402_18K_1%_0.0625W_100PPM: Resistor - 1%; Part Description: General Purpose Thick Film Chip Resistor; Manufacturer: GENERIC; Manufacturer1 Part Number: 232270671803L; TC: ±100ppm/°C; PressFit: No; Part Number: R0402_18K_1%_0.0625W_100PPM; Component Kind: Standard; Component Type: Standard; Pin Count: 2; Value: 18k; Status: Not Recommended; Power: 0.0625W; Manufacturer Part Number: R0402_18K_1%_0.0625W_100PPM; Case: 0402; Mounted: Yes; Sense: No; Socket: No; SMD: Yes; Manufacturer1 Example: YAGEO PHYCOMP; Manufacturer1 ComponentHeight: 0.4mm; HelpURL: \\cern.ch\dfs\Applications\Altium\Datasheets\R0402_Phycomp_RC0402.pdf; Author: CERN DEM JLC; CreateDate: 03.12.2007; LatestRevisionDate: 17.10.2012
R72 R153 R179 R218 = R0402_10K_1%_0.0625W_100PPM: Resistor - 1%; Part Description: General Purpose Thick Film Chip Resistor; Manufacturer: GENERIC; Manufacturer1 Part Number: 232270671003L; TC: ±100ppm/°C; Part Number: R0402_10K_1%_0.0625W_100PPM; Component Kind: Standard; Component Type: Standard; Pin Count: 2; Value: 10k; Status: Not recommended; Power: 0.0625W; Tolerance: ±1%; Manufacturer Part Number: R0402_10K_1%_0.0625W_100PPM; Case: 0402; Mounted: Yes; Sense: No; Socket: No; SMD: Yes; Manufacturer1 Example: YAGEO PHYCOMP; Manufacturer1 ComponentHeight: 0.4mm; HelpURL: \\cern.ch\dfs\Applications\Altium\Datasheets\R0402_Phycomp_RC0402.pdf; Author: CERN DEM JLC
  R72: CreateDate: 2007-12-03; LatestRevisionDate: 2012-10-17
  R153 R179 R218: CreateDate: 03.12.2007; LatestRevisionDate: 17.10.2012
R83 R157 = R0603_0R_JUMPER: Resistor; Part Description: 1A (0.05R Max DC Resistance) Zero Ohm Jumper; Manufacturer: GENERIC; Manufacturer1 Part Number: NRC06Z0; PressFit: No; Part Number: R0603_0R_JUMPER; Component Kind: Standard; Component Type: Standard; Pin Count: 2; Value: 0; Status: Preferred; Manufacturer Part Number: R0603_0R_JUMPER; Case: 0603; Mounted: Yes; Sense: No; Socket: No; SMD: Yes; Manufacturer1 Example: NIC COMPONENT; Manufacturer1 ComponentHeight: 0.55mm; HelpURL: \\cern.ch\dfs\Applications\Altium\Datasheets\R0603_NIC_NRC.pdf; Author: CERN DEM JLC; CreateDate: 03.12.2007; LatestRevisionDate: 13.03.2008
R91 = R0805_4R7_1%_0.125W_200PPM: Resistor - 1%; Part Description: General Purpose Thick Film Chip Resistor; Manufacturer: GENERIC; Manufacturer1 Part Number: 232273464708L or RC0805FR-074R7L; Power: 0.125W; TC: ±200ppm/°C; PressFit: No; Part Number: R0805_4R7_1%_0.125W_200PPM; Component Kind: Standard; Component Type: Standard; Pin Count: 2; Value: 4R7; Status: Preferred; Manufacturer Part Number: R0805_4R7_1%_0.125W_200PPM; Case: 0805; Mounted: Yes; Sense: No; Socket: No; SMD: Yes; Manufacturer1 Example: YAGEO PHYCOMP; Manufacturer1 ComponentHeight: 0.65mm; HelpURL: \\cern.ch\dfs\Applications\Altium\Datasheets\R0805_Phycomp_RC0805.pdf; Author: CERN DEM JLC; CreateDate: 03.12.2007; LatestRevisionDate: 17.10.2012
R97 R106 R216 = R0603_3k3_1%_0.1W_100PPM: Resistor - 1%; Part Description: General Purpose Thick Film Chip Resistor; Manufacturer: GENERIC; Manufacturer1 Part Number: NRC06F3301TRF; Power: 0.1W; TC: ±100ppm/°C; PressFit: No; Part Number: R0603_3K3_1%_0.1W_100PPM; Component Kind: Standard; Component Type: Standard; Pin Count: 2; Value: 3k3; Status: Preferred; Tolerance: ±1%; Manufacturer Part Number: R0603_3K3_1%_0.1W_100PPM; Case: 0603; Mounted: Yes; Sense: No; Socket: No; SMD: Yes; Manufacturer1 Example: NIC COMPONENT; Manufacturer1 ComponentHeight: 0.55mm; HelpURL: \\cern.ch\dfs\Applications\Altium\Datasheets\R0603_NIC_NRC.pdf; Author: CERN DEM JLC; CreateDate: 03.12.2007; LatestRevisionDate: 13.03.2008
R105 = R0402_0R_JUMPER: Resistor; Part Description: 1A (0.05R Max DC Resistance) Zero Ohm Jumper; Manufacturer: GENERIC; Manufacturer1 Part Number: 232270591001L; PressFit: No; Part Number: R0402_0R_JUMPER; Component Kind: Standard; Component Type: Standard; Pin Count: 2; Value: 0; Status: Not Recommended; Manufacturer Part Number: R0402_0R_JUMPER; Case: 0402; Mounted: Yes; Sense: No; Socket: No; SMD: Yes; Manufacturer1 Example: YAGEO PHYCOMP; Manufacturer1 ComponentHeight: 0.4mm; HelpURL: \\cern.ch\dfs\Applications\Altium\Datasheets\R0402_Phycomp_RC0402.pdf; Author: CERN DEM JLC; CreateDate: 03.12.2007; LatestRevisionDate: 17.10.2012
R108-R110 = R0603_1K_1%_0.1W_100PPM: Resistor - 1%; Manufacturer: GENERIC; Part Description: General Purpose Thick Film Chip Resistor; Manufacturer1 Part Number: NRC06F1001TRF; Power: 0.1W; TC: ±100ppm/°C; PressFit: No; Value: 1k; Manufacturer Part Number: R0603_1K_1%_0.1W_100PPM; Part Number: R0603_1K_1%_0.1W_100PPM; Component Kind: Standard; Component Type: Standard; Pin Count: 2; Status: Preferred; Tolerance: ±1%; Case: 0603; Mounted: Yes; Sense: No; Socket: No; SMD: Yes; Manufacturer1 Example: NIC COMPONENT; Manufacturer1 ComponentHeight: 0.55mm; HelpURL: \\cern.ch\dfs\Applications\Altium\Datasheets\R0603_NIC_NRC.pdf; Author: CERN DEM JLC; CreateDate: 03.12.2007; LatestRevisionDate: 13.03.2008
R180 = R0402_47K_1%_0.0625W_100PPM: Resistor - 1%; Part Description: General Purpose Thick Film Chip Resistor; Manufacturer: GENERIC; Manufacturer1 Part Number: 232270675103L; TC: ±100ppm/°C; PressFit: No; Part Number: R0402_47K_1%_0.0625W_100PPM; Component Kind: Standard; Component Type: Standard; Pin Count: 2; Value: 47k; Status: Not Recommended; Power: 0.0625W; Tolerance: ±1%; Manufacturer Part Number: R0402_47K_1%_0.0625W_100PPM; Case: 0402; Mounted: Yes; Sense: No; Socket: No; SMD: Yes; Manufacturer1 Example: YAGEO PHYCOMP; Manufacturer1 ComponentHeight: 0.4mm; HelpURL: \\cern.ch\dfs\Applications\Altium\Datasheets\R0402_Phycomp_RC0402.pdf; Author: CERN DEM JLC; CreateDate: 03.12.2007; LatestRevisionDate: 17.10.2012
RT1 = THERM_NTC_100K_VISHAY_NTCS0603E3104FXT: Thermistor NTC (Negative Temperature Coefficient); Part Description: SMD 0603, Glass Protected NTC Thermistor; Manufacturer: VISHAY; Power: 125mW; Tolerance: ±1%; Part Number: THERM_NTC_100K_VISHAY_NTCS0603E3104FXT; Component Kind: Standard; Component Type: Standard; Pin Count: 2; Value: 100k; Status: None; Manufacturer Part Number: NTCS0603E3104FXT; Case: 0603; Mounted: Yes; Socket: No; SMD: Yes; Sense: No; ComponentHeight: 0.95mm; HelpURL: \\cern.ch\dfs\Applications\Altium\Datasheets\THERM_VISHAY_NTCS0603E3.pdf; Author: CERN DEM JMW; CreateDate: 26.11.2019; LatestRevisionDate: 26.11.2019
T6 = SI4425DDY-T1-GE3: -30V -19.7A P-Channel MOSFET; Manufacturer: VISHAY SILICONIX; PressFit: No; Bonding: No; Part Number: SI4425DDY-T1-GE3; Component Kind: Standard; Component Type: Standard; Device: SI4425DDY-T1-GE3; PackageDescription: SOIC 8, Pitch 1.27mm - Body 4x5mm, IPC Medium Density; Part Description: -30V -19.7A P-Channel MOSFET; Manufacturer Part Number: SI4425DDY-T1-GE3; Pin Count: 8; Case: SOIC8; Mounted: Yes; Socket: No; SMD: Yes; Sense: No; ComponentHeight: 1.75mm; HelpURL: \\cern.ch\dfs\Applications\Altium\Datasheets\SI4425DDY-T1-GE3.pdf; Author: CERN DEM MR; CreateDate: 05/10/2016; LatestRevisionDate: 05/10/2016
T7 T14 = BSS138LT1G: N-CHANNEL MOSFET WITH DIODE; Part Description: 50V 200mA N-Channel Enhancement Mode Field-Effect Transistor; Manufacturer: ON SEMICONDUCTOR; PressFit: No; Bonding: No; Part Number: BSS138LT1G; Component Kind: Standard; Component Type: Standard; Device: BSS138LT1G; Manufacturer Part Number: BSS138LT1G; Pin Count: 3; Case: SOT23-3; Mounted: Yes; Socket: No; SMD: Yes; Sense: No; ComponentHeight: 1.11mm; HelpURL: \\cern.ch\dfs\Applications\Altium\Datasheets\BSS138LT1G.pdf; Author: CERN DEM JLC; CreateDate: 23.03.2009; LatestRevisionDate: 23.03.2009
  T7: PackageDescription: SOT23 3-Leads, Pitch 0.95mm - Body 1.4x3mm, IPC Medium Density
  T14: PackageDescription: SOT23, 0.95mm Pitch; 3 Pin, 1.40mm W X 3.00mm L X 1.10mm H body, IPC Medium Density
TP1 TP3-TP5 TP10 TP16 TP18 TP22 TP23 = SMD_PAD_1.27X1.27MM: Part Description: 1.27mm x 1.27mm PCB Copper Area (SMD Test Point); Mounted: No; Part Number: SMD_PAD_1.27X1.27MM; Component Kind: Standard (No BOM); Component Type: Standard (No BOM); Pin Count: 1; Family: Test Point; Socket: No; SMD: Yes; Sense: No; Status: None; ComponentHeight: 0mm; HelpURL: Undefined; Author: CERN DEM JLC; CreateDate: 12.01.2008; LatestRevisionDate: 12.01.2008; PackageDescription: 1.27mm x 1.27mm PCB Copper Area (SMD Test Point)
TP24 = NICOMATIC_C12000B: Part Description: SMD Test Point; PressFit: No; Status Comment: Sourcing Difficulties; Part Number: NICOMATIC_C12000B; Component Kind: Standard; Component Type: Standard; Pin Count: 1; Family: Test Point; Mounted: Yes; Socket: No; SMD: Yes; Sense: No; Status: Not Recommended; Manufacturer: NICOMATIC; Manufacturer Part Number: C12000B; ComponentHeight: 1.5mm; HelpURL: \\cern.ch\dfs\Applications\Altium\Datasheets\NICOMATIC_C12000B.pdf; Author: CERN DEM JLC; CreateDate: 25.03.2009; LatestRevisionDate: 10.08.2017
U1 = TC649EOA: PWM Fan Speed Controller with Auto-Shutdown and FanSense Technology, 8-Pin SOIC, Industrial Temperature; PackageReference: SOIC-OA8; Code_IPC: SOIC127P600-8; PackageDescription: 8-Lead Plastic Small Outline (OA) - Narrow, 3.90mm Body [SOIC]; DatasheetVersion: revC, Oct-2002; PackageVersion: revBB, Aug-2009

## Nets that join several sheets
GND: VHF_AMP_top (72 pins), Preamp (27 pins), PWR_stage (37 pins), RF_Driver (35 pins), VHFA_DIOT_Connectors_P1_P6 (34 pins), VHFA_EEM (32 pins), VHFA_PA_DCDC (191 pins), VHF_REV_RFD (27 pins), VHFA_PWR_Supply (58 pins), VHF_FWD_RFD (27 pins)
P2V5REF: VHF_AMP_top (6 pins), VHFA_PWR_Supply (C154.2 IC28.5 IC28.6)
P3V3: VHF_AMP_top (19 pins), VHFA_EEM (10 pins), VHFA_PWR_Supply (13 pins)
P3V3_MP: VHFA_DIOT_Connectors_P1_P6 (10 pins), VHFA_EEM (10 pins), VHFA_PWR_Supply (C102.1 IC33.5 R109.1 TP4.1)
P3V3A: VHF_AMP_top (R172.1 R173.1), VHF_REV_RFD (13 pins), VHFA_PWR_Supply (C63.2 IC31.3 R110.1 TP5.1), VHF_FWD_RFD (13 pins)
P5V0A: PWR_stage (5 pins), VHFA_PWR_Supply (6 pins)
P12V0: VHFA_DIOT_Connectors_P1_P6 (7 pins), VHFA_EEM (J9.28 J9.29), VHFA_PWR_Supply (6 pins)
P12V0_SW: Preamp (L7.1), RF_Driver (L11.1), VHFA_PA_DCDC (35 pins), VHFA_PWR_Supply (17 pins)
P48V0: PWR_stage (5 pins), VHFA_PA_DCDC (R64.2 R65.2 R66.2 R76.2), VHFA_PWR_Supply (R180.2 TP10.1)
BP_IO.LVDS_N0: VHFA_DIOT_Connectors_P1_P6 (J13.E3), VHFA_EEM (R235.1)
BP_IO.LVDS_N1: VHFA_DIOT_Connectors_P1_P6 (J13.B3), VHFA_EEM (R236.1)
BP_IO.LVDS_N2: VHFA_DIOT_Connectors_P1_P6 (J13.C4), VHFA_EEM (R241.1)
BP_IO.LVDS_N3: VHFA_DIOT_Connectors_P1_P6 (J13.L4), VHFA_EEM (R242.1)
BP_IO.LVDS_N4: VHFA_DIOT_Connectors_P1_P6 (J13.I4), VHFA_EEM (R243.1)
BP_IO.LVDS_N5: VHFA_DIOT_Connectors_P1_P6 (J13.K5), VHFA_EEM (R9.1)
BP_IO.LVDS_N6: VHFA_DIOT_Connectors_P1_P6 (J13.H5), VHFA_EEM (R247.1)
BP_IO.LVDS_N7: VHFA_DIOT_Connectors_P1_P6 (J13.F6), VHFA_EEM (R248.1)
BP_IO.LVDS_P0: VHFA_DIOT_Connectors_P1_P6 (J13.D3), VHFA_EEM (R3.1)
BP_IO.LVDS_P1: VHFA_DIOT_Connectors_P1_P6 (J13.A3), VHFA_EEM (R4.1)
BP_IO.LVDS_P2: VHFA_DIOT_Connectors_P1_P6 (J13.B4), VHFA_EEM (R5.1)
BP_IO.LVDS_P3: VHFA_DIOT_Connectors_P1_P6 (J13.K4), VHFA_EEM (R6.1)
BP_IO.LVDS_P4: VHFA_DIOT_Connectors_P1_P6 (J13.H4), VHFA_EEM (R7.1)
BP_IO.LVDS_P5: VHFA_DIOT_Connectors_P1_P6 (J13.J5), VHFA_EEM (R8.1)
BP_IO.LVDS_P6: VHFA_DIOT_Connectors_P1_P6 (J13.G5), VHFA_EEM (R151.1)
BP_IO.LVDS_P7: VHFA_DIOT_Connectors_P1_P6 (J13.E6), VHFA_EEM (R92.1)
CSN_N_ADC: VHF_AMP_top (R162.1 TP21.1), PWR_stage (IC37.5)
CSN_P_ADC: VHF_AMP_top (R161.1 TP20.1), PWR_stage (IC36.5)
DET_RMS_FWD: VHF_AMP_top (R47.1 TP31.1), VHF_FWD_RFD (IC12_VHF_FWD_RFD.1 R32_VHF_FWD_RFD.1 R52_VHF_FWD_RFD.1)
DET_RMS_REV: VHF_AMP_top (R156.1 TP32.1), VHF_REV_RFD (IC12_VHF_REV_RFD.1 R32_VHF_REV_RFD.1 R52_VHF_REV_RFD.1)
DET_RST: VHF_AMP_top (PB3.2 R170.2 R171.2 TP26.1), VHF_REV_RFD (IC9_VHF_REV_RFD.15 IC11_VHF_REV_RFD.1), VHF_FWD_RFD (IC9_VHF_FWD_RFD.15 IC11_VHF_FWD_RFD.1)
DET_TRH_FWD: VHF_AMP_top (IC8.24 R167.2 TP33.1), VHF_FWD_RFD (IC10_VHF_FWD_RFD.4 R53_VHF_FWD_RFD.1)
DET_TRH_REV: VHF_AMP_top (IC8.23 R168.2 TP34.1), VHF_REV_RFD (IC10_VHF_REV_RFD.4 R53_VHF_REV_RFD.1)
DRV_out_N: PWR_stage (R90.1), RF_Driver (R94.2)
DRV_out_P: PWR_stage (R81.1), RF_Driver (R93.2)
FINE_TUNE_0V_P2V5: VHF_AMP_top (J3.1 TP25.1), RF_Driver (R43.2)
I2C_SCL.CPCIS: VHFA_DIOT_Connectors_P1_P6 (IC14.9 IC14.10), VHFA_EEM (5 pins)
I2C_SDA.CPCIS: VHFA_DIOT_Connectors_P1_P6 (IC14.2 IC14.3), VHFA_EEM (5 pins)
NetC49_1: PWR_stage (C49.1), RF_Driver (TR4.4)
NetC100_2: VHF_AMP_top (C100.2), Preamp (R127.2 R134.1)
NetIC9_VHF_FWD_RFD_3: VHF_AMP_top (TP7.1), VHF_FWD_RFD (IC9_VHF_FWD_RFD.3)
NetIC9_VHF_REV_RFD_3: VHF_AMP_top (TP6.1), VHF_REV_RFD (IC9_VHF_REV_RFD.3)
NetIC11_VHF_FWD_RFD_15: VHF_AMP_top (R173.2), VHF_FWD_RFD (IC11_VHF_FWD_RFD.15)
NetIC11_VHF_REV_RFD_15: VHF_AMP_top (R172.2), VHF_REV_RFD (IC11_VHF_REV_RFD.15)
NetIC24_VHF_FWD_RFD_1: VHF_REV_RFD (IC24_VHF_REV_RFD.4), VHF_FWD_RFD (IC24_VHF_FWD_RFD.1)
NetIC26_3: VHF_AMP_top (TP13.1), VHFA_EEM (IC26.3 IC27.3 R61.2)
NetIC34_4: PWR_stage (IC34.4), VHF_REV_RFD (R111_VHF_REV_RFD.1 R112_VHF_REV_RFD.2)
NetIC34_5: PWR_stage (IC34.5), VHF_FWD_RFD (R111_VHF_FWD_RFD.1 R112_VHF_FWD_RFD.2)
NetIC34_8: VHF_AMP_top (J2.1), PWR_stage (IC34.8)
NetIC38_4: VHF_AMP_top (R170.1), VHFA_EEM (IC38.4)
NSHDN: VHF_AMP_top (IC29.4), VHFA_PA_DCDC (IC22.L4 R126.1)
PRE_out_N: Preamp (R96.2), RF_Driver (R101.2 R163.1)
PRE_out_P: Preamp (R129.2 R133.2), RF_Driver (R104.1)
PS_ON_BP: VHF_AMP_top (TP12.1), VHFA_DIOT_Connectors_P1_P6 (6 pins), VHFA_PWR_Supply (R153.1)
RF_DIS: VHF_AMP_top (R177.1 TP2.1 TP11.1), VHFA_EEM (R45.1), VHF_REV_RFD (IC24_VHF_REV_RFD.1)
RF_OFF: VHF_AMP_top (PB1.3 PB2.1 TP28.1), VHF_FWD_RFD (IC24_VHF_FWD_RFD.4)
SPI_MISO: VHF_AMP_top (R175.1 R176.1), VHFA_EEM (R35.1)
SPI_MOSI: VHF_AMP_top (IC8.7 IC19.7), VHFA_EEM (R16.1)
SPI_NCS1: VHF_AMP_top (IC19.8), VHFA_EEM (R39.1)
SPI_NCS2: VHF_AMP_top (IC8.8), VHFA_EEM (R169.1)
SPI_SCK: VHF_AMP_top (IC8.6 IC19.6), VHFA_EEM (R37.1)
VBIAS_N_DAC: VHF_AMP_top (P2.2 R181.2 TP29.1), PWR_stage (IC20.5)
VBIAS_P_DAC: VHF_AMP_top (P1.2 R174.2 TP27.1), PWR_stage (IC20.3)

## Assembly variants
std: all parts fitted